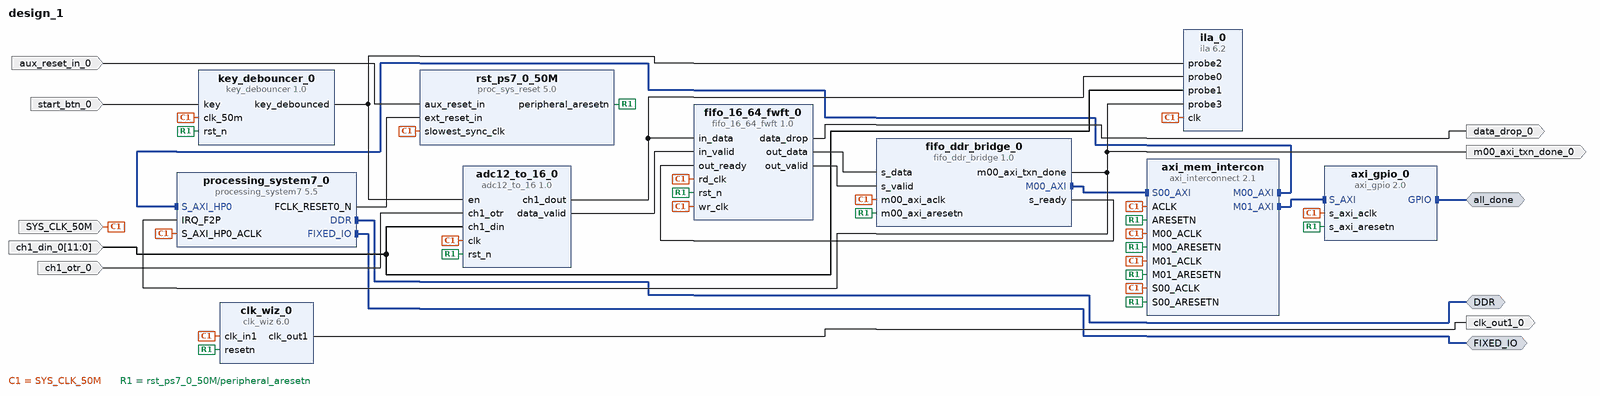
[diagram p0: block diagram of the top level]
# Vivado block design design_1, xc7z020clg484-2, Vivado 2025.1
create_bd_design design_1

create_bd_intf_port -mode Master -vlnv xilinx.com:interface:ddrx_rtl:1.0 DDR
create_bd_intf_port -mode Master -vlnv xilinx.com:display_processing_system7:fixedio_rtl:1.0 FIXED_IO
create_bd_intf_port -mode Master -vlnv xilinx.com:interface:gpio_rtl:1.0 all_done
create_bd_port -dir I start_btn_0
create_bd_port -dir I -from 11 -to 0 ch1_din_0
create_bd_port -dir I ch1_otr_0
create_bd_port -dir O -type clk clk_out1_0
create_bd_port -dir O m00_axi_txn_done_0
create_bd_port -dir O data_drop_0
create_bd_port -dir I -type rst aux_reset_in_0
create_bd_port -dir I -type clk SYS_CLK_50M
set_property -dict {CONFIG.FREQ_HZ 50000000} [get_bd_ports SYS_CLK_50M]

create_bd_cell -type ip -vlnv xilinx.com:ip:processing_system7:5.5 processing_system7_0
set_property -dict [list \
  CONFIG.PCW_EN_CLK0_PORT 0 \
  CONFIG.PCW_IRQ_F2P_INTR 1 \
  CONFIG.PCW_UART1_PERIPHERAL_ENABLE 1 \
  CONFIG.PCW_UART1_UART1_IO {MIO 48 .. 49} \
  CONFIG.PCW_UART_PERIPHERAL_FREQMHZ 100 \
  CONFIG.PCW_UIPARAM_DDR_PARTNO {MT41K256M16 RE-125} \
  CONFIG.PCW_UIPARAM_GENERATE_SUMMARY NONE \
  CONFIG.PCW_USE_FABRIC_INTERRUPT 1 \
  CONFIG.PCW_USE_M_AXI_GP0 0 \
  CONFIG.PCW_USE_S_AXI_HP0 1 \
] [get_bd_cells processing_system7_0]
# 48 more settings of processing_system7_0 are not shown: defaults, MIO pin electricals, DDR timing, and values the tool derives
create_bd_cell -type ip -vlnv xilinx.com:user:fifo_ddr_bridge:1.0 fifo_ddr_bridge_0
set_property -dict {CONFIG.C_M_TOTAL_BURST 5000} [get_bd_cells fifo_ddr_bridge_0]
create_bd_cell -type ip -vlnv xilinx.com:ip:axi_interconnect:2.1 axi_mem_intercon
set_property -dict {CONFIG.NUM_MI 2} [get_bd_cells axi_mem_intercon]
create_bd_cell -type ip -vlnv xilinx.com:ip:proc_sys_reset:5.0 rst_ps7_0_50M
create_bd_cell -type ip -vlnv xilinx.com:user:fifo_16_64_fwft:1.0 fifo_16_64_fwft_0
create_bd_cell -type ip -vlnv xilinx.com:user:adc12_to_16:1.0 adc12_to_16_0
create_bd_cell -type ip -vlnv xilinx.com:ip:clk_wiz:6.0 clk_wiz_0
set_property -dict [list \
  CONFIG.CLKOUT1_DRIVES BUFGCE \
  CONFIG.CLKOUT1_JITTER 192.113 \
  CONFIG.CLKOUT1_REQUESTED_OUT_FREQ 50 \
  CONFIG.CLKOUT2_DRIVES BUFGCE \
  CONFIG.CLKOUT3_DRIVES BUFGCE \
  CONFIG.CLKOUT4_DRIVES BUFGCE \
  CONFIG.CLKOUT5_DRIVES BUFGCE \
  CONFIG.CLKOUT6_DRIVES BUFGCE \
  CONFIG.CLKOUT7_DRIVES BUFGCE \
  CONFIG.FEEDBACK_SOURCE FDBK_AUTO \
  CONFIG.MMCM_CLKOUT0_DIVIDE_F 20.000 \
  CONFIG.PRIM_SOURCE Global_buffer \
  CONFIG.RESET_PORT resetn \
  CONFIG.RESET_TYPE ACTIVE_LOW \
  CONFIG.USE_LOCKED false \
  CONFIG.USE_RESET true \
  CONFIG.USE_SAFE_CLOCK_STARTUP true \
] [get_bd_cells clk_wiz_0]
create_bd_cell -type ip -vlnv xilinx.com:ip:ila:6.2 ila_0
set_property -dict [list \
  CONFIG.C_MONITOR_TYPE Native \
  CONFIG.C_NUM_OF_PROBES 4 \
  CONFIG.C_PROBE0_WIDTH 16 \
  CONFIG.C_PROBE1_WIDTH 12 \
] [get_bd_cells ila_0]
create_bd_cell -type ip -vlnv xilinx.com:user:key_debouncer:1.0 key_debouncer_0
create_bd_cell -type ip -vlnv xilinx.com:ip:axi_gpio:2.0 axi_gpio_0
set_property -dict {CONFIG.C_ALL_INPUTS 0 CONFIG.C_GPIO_WIDTH 1 CONFIG.C_TRI_DEFAULT 0x00000010} [get_bd_cells axi_gpio_0]

# ---- connections ----

connect_bd_intf_net [get_bd_intf_ports all_done] [get_bd_intf_pins axi_gpio_0/GPIO]
connect_bd_intf_net [get_bd_intf_pins axi_mem_intercon/M00_AXI] [get_bd_intf_pins processing_system7_0/S_AXI_HP0]
connect_bd_intf_net [get_bd_intf_pins axi_mem_intercon/M01_AXI] [get_bd_intf_pins axi_gpio_0/S_AXI]
connect_bd_intf_net [get_bd_intf_pins fifo_ddr_bridge_0/M00_AXI] [get_bd_intf_pins axi_mem_intercon/S00_AXI]
connect_bd_intf_net [get_bd_intf_ports DDR] [get_bd_intf_pins processing_system7_0/DDR]
connect_bd_intf_net [get_bd_intf_ports FIXED_IO] [get_bd_intf_pins processing_system7_0/FIXED_IO]
connect_bd_net [get_bd_ports SYS_CLK_50M] \
  [get_bd_pins adc12_to_16_0/clk] [get_bd_pins clk_wiz_0/clk_in1] [get_bd_pins fifo_16_64_fwft_0/rd_clk] \
  [get_bd_pins fifo_16_64_fwft_0/wr_clk] [get_bd_pins axi_mem_intercon/S00_ACLK] [get_bd_pins rst_ps7_0_50M/slowest_sync_clk] \
  [get_bd_pins axi_mem_intercon/ACLK] [get_bd_pins axi_mem_intercon/M00_ACLK] \
  [get_bd_pins processing_system7_0/S_AXI_HP0_ACLK] [get_bd_pins ila_0/clk] [get_bd_pins key_debouncer_0/clk_50m] \
  [get_bd_pins axi_gpio_0/s_axi_aclk] [get_bd_pins axi_mem_intercon/M01_ACLK] [get_bd_pins fifo_ddr_bridge_0/m00_axi_aclk]
connect_bd_net [get_bd_pins adc12_to_16_0/ch1_dout] [get_bd_pins fifo_16_64_fwft_0/in_data] [get_bd_pins ila_0/probe0]
connect_bd_net [get_bd_pins adc12_to_16_0/data_valid] [get_bd_pins fifo_16_64_fwft_0/in_valid]
connect_bd_net -net aux_reset_in_0_1 [get_bd_ports aux_reset_in_0] [get_bd_pins rst_ps7_0_50M/aux_reset_in]
connect_bd_net -net button_ctrl_0_y [get_bd_pins key_debouncer_0/key_debounced] [get_bd_pins adc12_to_16_0/en] [get_bd_pins ila_0/probe2]
connect_bd_net -net ch1_din_0_1 [get_bd_ports ch1_din_0] [get_bd_pins adc12_to_16_0/ch1_din] [get_bd_pins ila_0/probe1]
connect_bd_net -net ch1_otr_0_1 [get_bd_ports ch1_otr_0] [get_bd_pins adc12_to_16_0/ch1_otr]
connect_bd_net [get_bd_pins clk_wiz_0/clk_out1] [get_bd_ports clk_out1_0]
connect_bd_net [get_bd_pins fifo_16_64_fwft_0/data_drop] [get_bd_ports data_drop_0]
connect_bd_net [get_bd_pins fifo_16_64_fwft_0/out_data] [get_bd_pins fifo_ddr_bridge_0/s_data]
connect_bd_net [get_bd_pins fifo_16_64_fwft_0/out_valid] [get_bd_pins fifo_ddr_bridge_0/s_valid]
connect_bd_net [get_bd_pins fifo_ddr_bridge_0/m00_axi_txn_done] \
  [get_bd_ports m00_axi_txn_done_0] [get_bd_pins ila_0/probe3] [get_bd_pins processing_system7_0/IRQ_F2P]
connect_bd_net [get_bd_pins fifo_ddr_bridge_0/s_ready] [get_bd_pins fifo_16_64_fwft_0/out_ready]
connect_bd_net [get_bd_pins processing_system7_0/FCLK_RESET0_N] [get_bd_pins rst_ps7_0_50M/ext_reset_in]
connect_bd_net [get_bd_pins rst_ps7_0_50M/peripheral_aresetn] \
  [get_bd_pins axi_mem_intercon/S00_ARESETN] [get_bd_pins axi_mem_intercon/M00_ARESETN] \
  [get_bd_pins axi_mem_intercon/ARESETN] [get_bd_pins adc12_to_16_0/rst_n] [get_bd_pins clk_wiz_0/resetn] \
  [get_bd_pins fifo_16_64_fwft_0/rst_n] [get_bd_pins key_debouncer_0/rst_n] [get_bd_pins axi_gpio_0/s_axi_aresetn] \
  [get_bd_pins axi_mem_intercon/M01_ARESETN] [get_bd_pins fifo_ddr_bridge_0/m00_axi_aresetn]
connect_bd_net -net start_btn_0_1 [get_bd_ports start_btn_0] [get_bd_pins key_debouncer_0/key]

# ---- address map ----
assign_bd_address -offset 0x00000000 -range 1G -target_address_space [get_bd_addr_spaces fifo_ddr_bridge_0/M00_AXI] [get_bd_addr_segs processing_system7_0/S_AXI_HP0/HP0_DDR_LOWOCM]
assign_bd_address -offset 0x40000000 -range 64K -target_address_space [get_bd_addr_spaces fifo_ddr_bridge_0/M00_AXI] [get_bd_addr_segs axi_gpio_0/S_AXI/Reg]

validate_bd_design
save_bd_design
